# Altium schematic sheet mcu.SchDoc
size A4; SheetNumber: 3; SheetTotal: 6
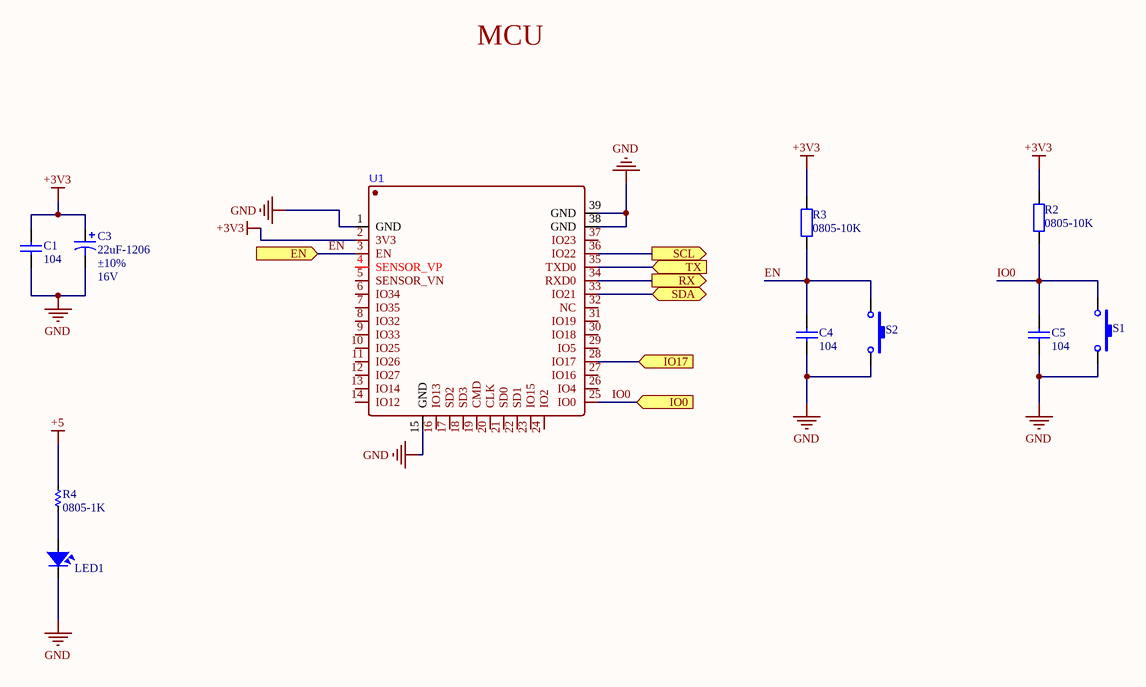
[diagram p0: mcu.SchDoc]

## Parts
C1  104  [0805]
C3  22uF-1206  Tolerance: ±10%  Voltage - Rated: 16V  [CAP1206_TANTALUM_YELLOW]
C4  104  [0805]
C5  104  [0805]
LED1  LED  [LED-0805-Orange]  (value not drawn)
R2  value 0805-10K  [DIEN TRO 0805]  (hidden comment: R0805)
R3  value 0805-10K  [DIEN TRO 0805]  (hidden comment: R0805)
R4  0805-1K  [RES-SMD-0805]
S1  MH001036  [SW-SMD]  (value not drawn)
S2  MH001036  [SW-SMD]  (value not drawn)
U1  ESP32-WROOM-32D-N8  [ESP32-SMD]  (value not drawn)

## Ports
EN (in), IO0 (in), IO17 (in), RX (out), SCL (out), SDA (bidir), TX (in)

## Nets
+3V3: C1.2 C3.1 R2.2 R3.2 U1.2(3V3)
+5: R4.1
GND: C1.1 C3.2 C4.1 C5.1 LED1.2 S1.2 S2.2 U1.1(GND) U1.15(GND) U1.38(GND) U1.39(GND)
EN: C4.2 R3.1 S2.1 U1.3(EN) ; port EN
IO0: C5.2 R2.1 S1.1 U1.25(IO0) ; port IO0
IO17: U1.28(IO17) ; port IO17
RX: U1.34(RXD0) ; port RX
SCL: U1.36(IO22) ; port SCL
SDA: U1.33(IO21) ; port SDA
TX: U1.35(TXD0) ; port TX
NetLED1_1: LED1.1 R4.2

Not connected (* = marked no-connect by the designer): U1 4(SENSOR_VP) 5(SENSOR_VN) 6(IO34) 7(IO35) 8(IO32) 9(IO33) 10(IO25) 11(IO26) 12(IO27) 13(IO14) 14(IO12) 16(IO13) 17(SD2) 18(SD3) 19(CMD) 20(CLK) 21(SD0) 22(SD1) 23(IO15) 24(IO2) 26(IO4) 27(IO16) 29(IO5) 30(IO18) 31(IO19) 32(NC) 37(IO23)

## Notes on the sheet
- MCU

## Library data of the parts
C1 C4 C5 = Cap 104_SMD: Capacitor (Semiconductor SIM Model); Value: 0.1uF; Published: 8-Jun-2000; LatestRevisionDate: 17-Jul-2002; LatestRevisionNote: Re-released for DXP Platform.; PackageReference: C1206; Publisher: Altium Limited
C3 = T491A106K016AT: CAP TANT 10UF 16V 10% 1206; Manufacturer 1: KEMET; Manufacturer Size Code: A; Category 1: Capacitors; Capacitance: 10µF; Type: Molded; ESR (Equivalent Series Resistance): 7 Ohm; Lifetime @ Temp.: 2000 Hrs @ 85°C; Supplier 1: Digi-Key; Supplier Part Number 1: 399-8269-1-ND; Manufacturer Part Number 1: T491A106K016AT; RoHS 1: RoHS Compliant; Description 1: CAP TANT 10UF 16V 10% 1206; Stock 1: 54083; Pricing 1: 1=0.45, 10=0.312, 100=0.1873, 500=0.14048, 1000=0.11862 (USD); Packaging: Cut Tape (CT); Part Status: Active; Operating Temperature: -55°C ~ 125°C; Mounting Type: Surface Mount; Package / Case: 1206 (3216 Metric); Size / Dimension: 0.126" L x 0.063" W (3.20mm x 1.60mm); Height - Seated (Max): 0.071" (1.80mm); Lead Spacing: -; Features: General Purpose; Failure Rate: -; ComponentLink1URL: http://www.kemet.com/Lists/ProductCatalog/Attachments/254/KEM_T2005_T491.pdf; ComponentLink1Description: http://www.kemet.com/Lists/ProductCatalog/Attachments/254/KEM_T2005_T491.pdf; Value: 10uF
LED1 = LED SMD: Value: LED 3 - 5 ly 2 Colour
R2 R3 = R0805: Resistor SMD 0805; Published: 8-Jun-2000; LatestRevisionDate: 17-Jul-2002; LatestRevisionNote: Re-released for DXP Platform.; PackageReference: AXIAL-0.4; Publisher: Altium Limited
R4 = Res-SMD: Resistor; Manufacturer: Generic Components; Class: Passive; Published: 08/06/2000; Publisher: Altium Hobart Technology Centre
S1 S2 = SW-SMD: Dán; Value: Nút Nhấn 2 Chân 3x6x2.5MM SMD